# Altium schematic sheet PIN.SchDoc
size A4; Organization: Altium Limited; Address1: L3, 12a Rodborough Rd; Address2: Frenchs Forest; Address3: NSW; Address4: Australia 2086
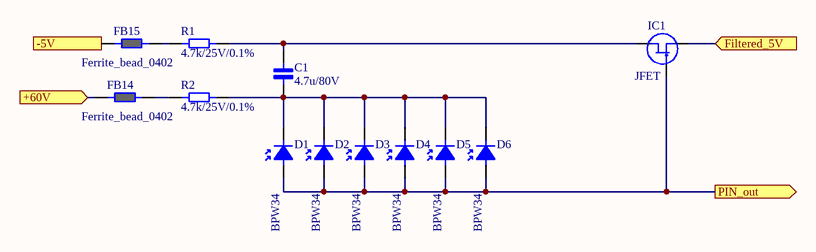
[diagram p0: PIN.SchDoc]

## Parts
C1  4.7u/80V  [CAP_1210]
D1  BPW34  [BPW34]
D2  BPW34  [BPW34]
D3  BPW34  [BPW34]
D4  BPW34  [BPW34]
D5  BPW34  [BPW34]
D6  BPW34  [BPW34]
FB14  Ferrite_bead_0402  [FERRITE_0402]
FB15  Ferrite_bead_0402  [FERRITE_0402]
IC1  JFET  [SOT23-3]
R1  4.7k/25V/0.1%  [RES_0603]
R2  4.7k/25V/0.1%  [RES_0603]

## Ports
+60V (in), -5V (in), Filtered_5V (in), PIN_out (out)

## Nets
+60V: FB14.1 ; port +60V
-5V: FB15.1 ; port -5V
Filtered_5V: IC1.2(D) ; port Filtered_5V
PIN_out: D1.1 D2.1 D3.1 D4.1 D5.1 D6.1 IC1.3(G) ; port PIN_out
NetC1_1: C1.1 D1.2 D2.2 D3.2 D4.2 D5.2 D6.2 R2.2
NetC1_2: C1.2 IC1.1(S) R1.2
NetFB14_2: FB14.2 R2.1
NetFB15_2: FB15.2 R1.1

## Notes on the sheet
- Title
- Size:
- Date:
- A4
- Number:
- Time:
- Revision:
- Sheet
- of
- File:

## Library data of the parts
C1 = Cap_1210_4.7u: Multilayer Ceramic Capacitors MLCC - SMD/SMT 1210 4.7uF 80volts *Derate Voltage/Temp; Manufacturer: Murata; Manufacturer Part Number: GRM32ER71K475KE14L; Voltage Rating (DC): 80V; Dielectric: X7R; Tolerance: 10%; Supplier 1: Digi-Key; RoHS: Yes; Category: Ceramic Capacitors; Stock 1: 275397; Pricing 1: 1=1.05000, 10=0.79900, 50=0.66340, 100=0.57130, 500=0.44234 (USD); Mount: Surface Mount; Case/Package: 1210; Weight: 0.00388oz; Dielectric Material: Ceramic; Case Code (Metric): 3225; Case Code (Imperial): 1210; Min Operating Temperature: -55°C; Max Operating Temperature: 125°C; Package Quantity: 1000; Packaging: Tape and Reel; Voltage Rating: 80V; Voltage: 80V; Termination: SMD/SMT; Capacitance: 4.7uF; Length: 3.2mm; Width: 2.5mm; Height: 2.5mm; Thickness: 0.106inch; Depth: 2.5mm; Lead Free: Lead Free; ComponentLink1URL: http://www.mouser.com/ds/2/281/c02e-2905.pdf?src-supplier=Mouser; ComponentLink1Description: http://www.mouser.com/ds/2/281/c02e-2905.pdf?src-supplier=Mouser; ComponentLink2URL: http://search.murata.co.jp/Ceramy/image/img/A01X/G101/ENG/GRM32ER71K475KE14-01.pdf?src-supplier=Digi-Key; ComponentLink2Description: http://search.murata.co.jp/Ceramy/image/img/A01X/G101/ENG/GRM32ER71K475KE14-01.pdf?src-supplier=Digi-Key
D1-D6 = BPW34 PIN Photodiode: VBPW34S, Pin photodiode, 60V reverse bias max; ComponentLink1Description: New link; ComponentLink1URL: https://pl.mouser.com/datasheet/2/427/vbpw34s-1766836.pdf
FB14 FB15 = Ferrite_bead_0402: Ferrite bead, wurth 74269241102
IC1 = BF861C: Trans JFET N-CH 25V 3-Pin TO-236AB; Manufacturer: NXP Semiconductors; Supplier 1: Arrow Electronics; Manufacturer Part Number: BF861C; RoHS: Yes; Category: Uncategorized; Number of Pins: 3; ComponentLink1URL: http://docs-usa.electrocomponents.com/techlib:/itc_doclist_US.htm?stockno=6262412&src-supplier=Allied+Electronics; ComponentLink1Description: http://docs-usa.electrocomponents.com/techlib:/itc_doclist_US.htm?stockno=6262412&src-supplier=Allied+Electronics; Supplier Part Number 1: BF861C
R1 R2 = Res_0603_4.7k: Vishay, thin film resistor 4.7k/25V/0.1%